# Altium project carte_action.PrjPcb
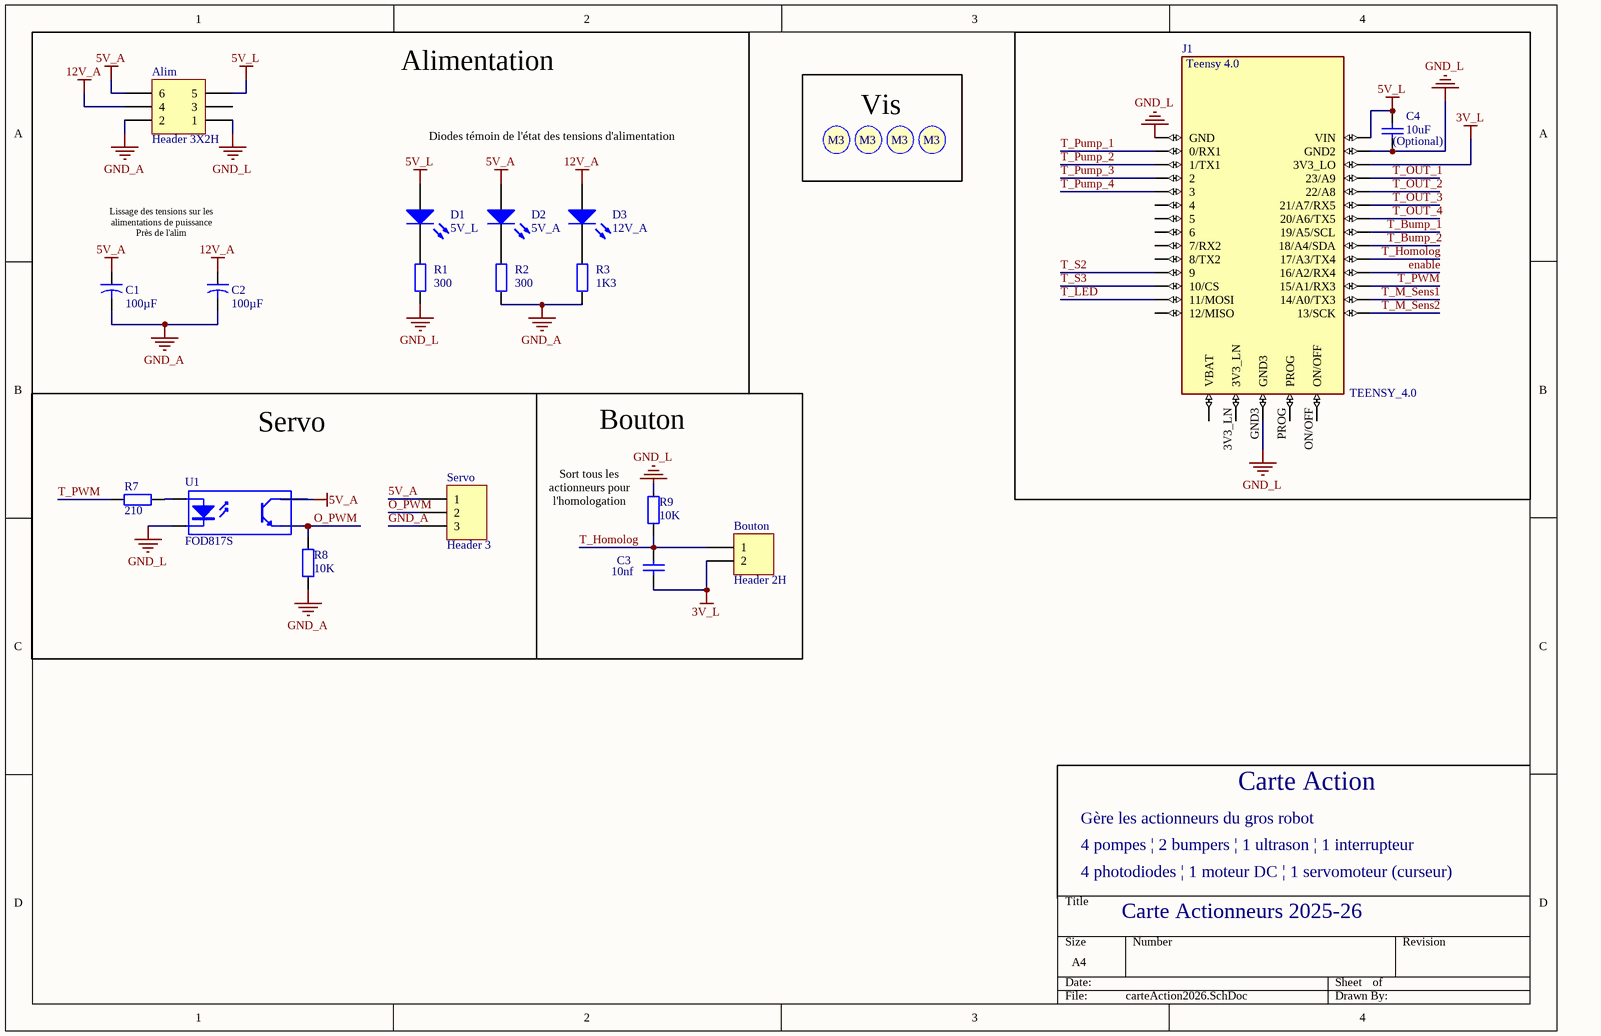
[diagram p0: carteAction2026.SchDoc]
2 sheets, 56 parts. Net scope: global (net labels, ports and power ports of the same name join across sheets).
Board file: PCBAction.PcbDoc
Sheets:
  carteAction2026.SchDoc
  SchemaAction_Actionneurs.SchDoc

## Sheet carteAction2026.SchDoc: Carte Actionneurs 2024-2025
size A4; DrawnBy: Oriane Doucet; DocumentNumber: 1/2; Revision: V1; SheetNumber: 1; SheetTotal: 2

### Parts
(Parts that share a designator on the sheet are numbered #1, #2 ... from top to bottom, then left to right.)
Alim  Header 3X2H  [MOLEX_MINIFITJR_3X2]
Bouton  Header 2H  [S2B-XH-A]
C1  value 100µF  [Condensateur]  (hidden comment: Cap2)
C2  value 100µF  [Condensateur]  (hidden comment: Cap2)
C3  value 10nf  [Capacitor 1206]  (hidden comment: Cap)
C4  (Optional)  value 10uF  [Capacitor 1206]
D1  5V_L  [KP-3216SEC]
D2  5V_A  [KP-3216SEC]
D3  12V_A  [KP-3216SEC]
J1  TEENSY_4.0  [TEENSY_4.0]
R1  value 300  [Resistor 1206]  (hidden comment: Res2)
R2  value 300  [Resistor 1206]  (hidden comment: Res2)
R3  value 1K3  [Resistor 1206]  (hidden comment: Res2)
R7  210  [Resistor 1206]
R8  value 10K  [Resistor 1206]  (hidden comment: Res2)
R9  value 10K  [Resistor 1206]  (hidden comment: Res2)
S1  Screw M3  [Screw M3]  (value not drawn)
S2  Screw M3  [Screw M3]  (value not drawn)
S3  Screw M3  [Screw M3]  (value not drawn)
S4  Screw M3  [Screw M3]  (value not drawn)
Servo  Header 3  [S3B-XH-A]
U1#1  FOD817S  [SOP254P1016X385-4N]

### Nets
3V_L: Bouton.2 C3.1 J1.3V3_LO
5V_A: Alim.6 C1.1 D2.1(A) Servo.1 U1#1.4(C)
5V_L: Alim.5 C4.2 D1.1(A) J1.VIN
12V_A: Alim.4 C2.1 D3.1(A)
GND_A: Alim.2 C1.2 C2.2 R2.2 R3.2 R8.1 Servo.3
GND_L: Alim.1 C4.1 J1.GND J1.GND2 J1.GND3 R1.1 R9.1 U1#1.2(K)
enable: J1.16/A2(16/A2/RX4)
O_PWM: R8.2 Servo.2 U1#1.3(E)
T_Bump_1: J1.19/A5/SCL
T_Bump_2: J1.18/A4/SDA
T_Homolog: Bouton.1 C3.2 J1.17/A3(17/A3/TX4) R9.2
T_LED: J1.11/MOSI
T_M_Sens1: J1.14/A0(14/A0/TX3)
T_M_Sens2: J1.13/SCK
T_OUT_1: J1.23/A9
T_OUT_2: J1.22/A8
T_OUT_3: J1.21/A7(21/A7/RX5)
T_OUT_4: J1.20/A6(20/A6/TX5)
T_Pump_1: J1.0/RX(0/RX1)
T_Pump_2: J1.1/TX(1/TX1)
T_Pump_3: J1.2
T_Pump_4: J1.3/CANTX(3)
T_PWM: J1.15/A1(15/A1/RX3) R7.1
T_S2: J1.9/CS(9)
T_S3: J1.10/CS
NetD1_2: D1.2(K) R1.2
NetD2_2: D2.2(K) R2.1
NetD3_2: D3.2(K) R3.1
NetR7_2: R7.2 U1#1.1(A)

Not connected (* = marked no-connect by the designer): Alim 3; J1 3V3_LN 4/CANRX(4) 5 6 7(7/RX2) 8(8/TX2) 12/MISO ON/OFF PROG VBAT\(VBAT)

### Notes on the sheet
- Alimentation
- Vis
- Diodes témoin de l'état des tensions d'alimentation
- Lissage des tensions sur les alimentations de puissance
  Près de l'alim
- Servo
- Bouton
- (near R9) Sort tous les actionneurs pour l'homologation
- 4 pompes | 2 bumpers | 1 ultrason | 1 interrupteur
- Gère les actionneurs du gros robot
- Carte Action
- 4 photodiodes | 1 moteur DC | 1 servomoteur (curseur)
- Carte Actionneurs 2025-26
- (in symbol Screw M3) M3

### Library data of the parts
Alim = Header 3X2H: Header, 3-Pin, Dual row, Right Angle; LatestRevisionDate: 17-Jul-2002; LatestRevisionNote: Re-released for DXP Platform.; Publisher: Altium Limited
Bouton = Header 2H: Header, 2-Pin, Right Angle; LatestRevisionDate: 17-Jul-2002; LatestRevisionNote: Re-released for DXP Platform.; Publisher: Altium Limited
C1 C2 = Cap2: Capacitor; Published: 23-Sep-2002; PackageReference: CAPR5-4X5; Publisher: Altium Limited; PackageDescription: Capacitor; 2 Leads
C3 C4 = Cap: Capacitor; Published: 8-Jun-2000; LatestRevisionDate: 17-Jul-2002; LatestRevisionNote: Re-released for DXP Platform.; PackageReference: RAD-0.3; Publisher: Altium Limited; PackageDescription: Radial Cap, Thru-Hole; 2 Leads; 0.3 in Pin Spacing
D1-D3 = LED2: Typical RED, GREEN, YELLOW, AMBER GaAs LED; Published: 8-Jun-2000; LatestRevisionDate: 17-Jul-2002; LatestRevisionNote: Re-released for DXP Platform.; PackageVersion: Feb-2002; PackageReference: 3.2X1.6X1.1; Publisher: Altium Limited; PackageDescription: SM LED; 2 Flat Leads
J1 = TEENSY_4.0: MF: PJRC; MP: Teensy 4.0; SnapEDA_Link: https://www.snapeda.com/parts/Teensy%204.0/PJRC/view-part/?ref=snap; Package: None; Value: *; Check_prices: https://www.snapeda.com/parts/Teensy%204.0/PJRC/view-part/?ref=eda
R1-R3 R7-R9 = Res2: Resistor; Published: 8-Jun-2000; LatestRevisionDate: 17-Jul-2002; LatestRevisionNote: Re-released for DXP Platform.; PackageReference: AXIAL-0.4; Publisher: Altium Limited; PackageDescription: Axial Device, Thru-Hole; 2 Leads; 0.4 in Pin Spacing
Servo = Header 3: Header, 3-Pin; LatestRevisionDate: 17-Jul-2002; LatestRevisionNote: Re-released for DXP Platform.; Publisher: Altium Limited
U1#1 = Optoisolator1: 4-Pin Phototransistor Optocoupler; Published: 24-Mar-1999; LatestRevisionDate: 04-Mar-2005; LatestRevisionNote: Sch pins 3 & 4 Swapped.; DatasheetVersion: Nov-2003; PackageReference: DIP-4; Publisher: Altium Limited

## Sheet SchemaAction_Actionneurs.SchDoc: Carte Actionneurs 2024-2025
size A4; DrawnBy: Oriane Doucet; DocumentNumber: 2/2; Revision: V1; SheetNumber: 2; SheetTotal: 2
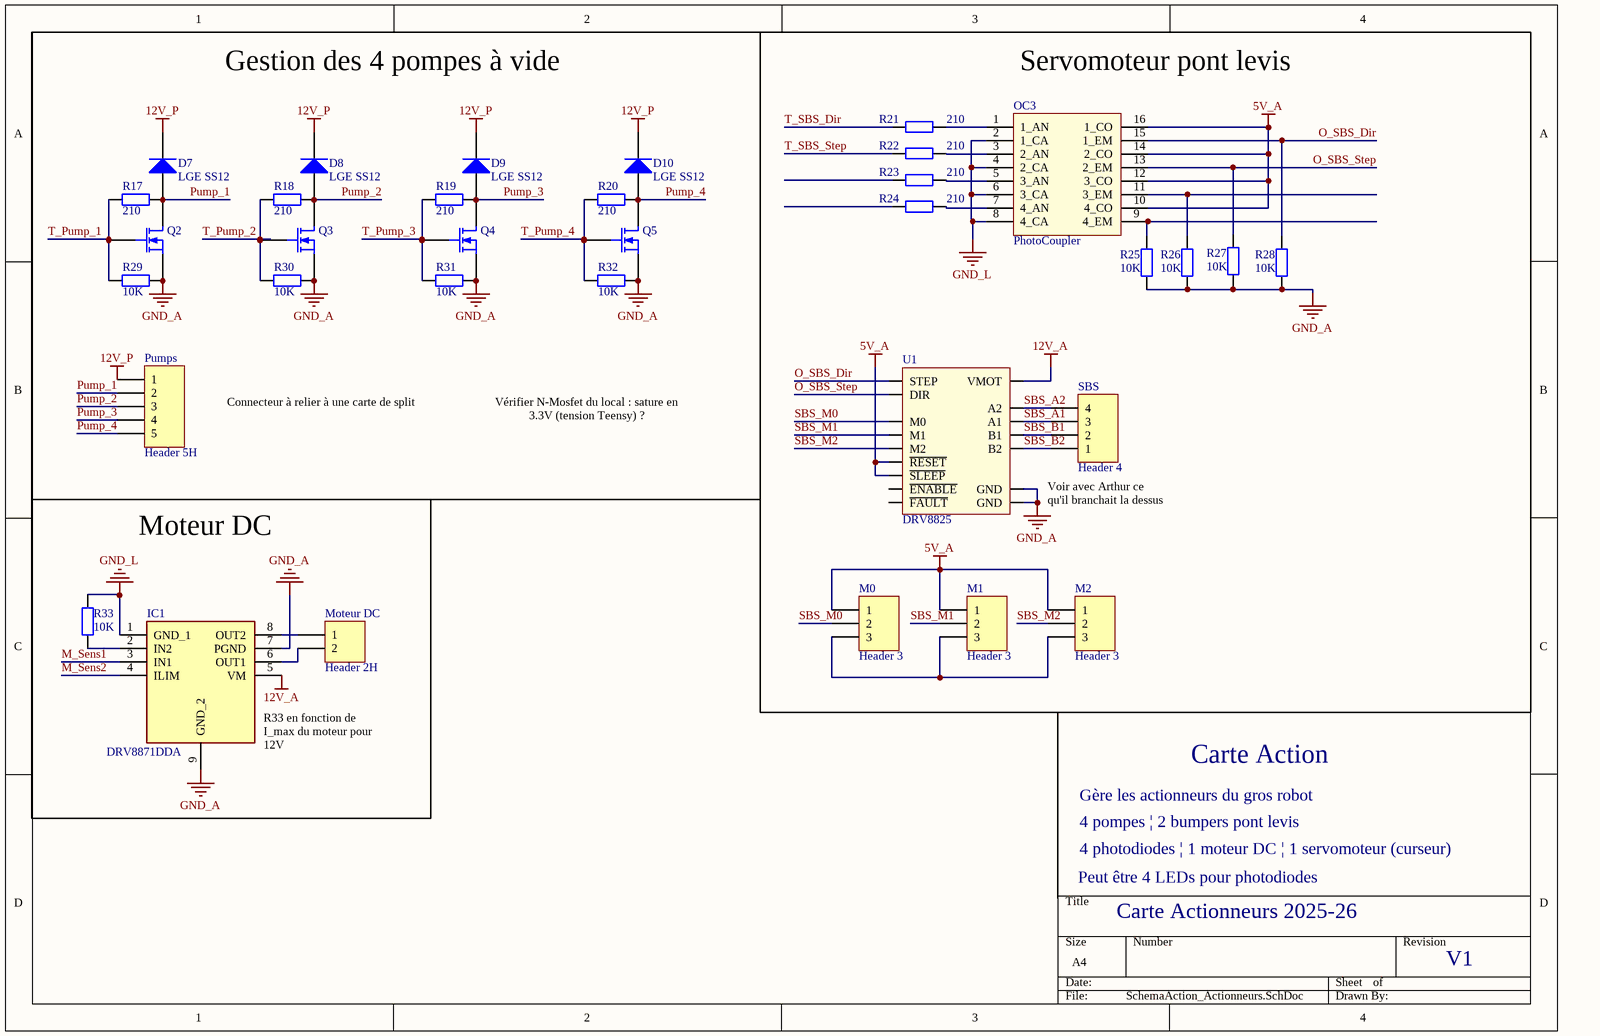
[diagram p1: SchemaAction_Actionneurs.SchDoc]

### Parts
(Parts that share a designator on the sheet are numbered #1, #2 ... from top to bottom, then left to right.)
D7  LGE SS12  [SMB]
D8  LGE SS12  [SMB]
D9  LGE SS12  [SMB]
D10  LGE SS12  [SMB]
IC1  DRV8871DDA  [SOIC127P600X170-9N]
M0  Header 3  [HDR1X3]
M1  Header 3  [HDR1X3]
M2  Header 3  [HDR1X3]
Moteur_DC  Header 2H  [HDR1X2H]
OC3  PhotoCoupler  [16 pins SOIC, TI]
Pumps  Header 5H  [HDR1X5H]
Q2  MOSFET-N  [SOT23_M]  (value not drawn)
Q3  MOSFET-N  [SOT23_M]  (value not drawn)
Q4  MOSFET-N  [SOT23_M]  (value not drawn)
Q5  MOSFET-N  [SOT23_M]  (value not drawn)
R17  value 210  [Resistor 1206]  (hidden comment: Res2)
R18  value 210  [Resistor 1206]  (hidden comment: Res2)
R19  value 210  [Resistor 1206]  (hidden comment: Res2)
R20  value 210  [Resistor 1206]  (hidden comment: Res2)
R21  value 210  [Resistor 1206]  (hidden comment: Res2)
R22  value 210  [Resistor 1206]  (hidden comment: Res2)
R23  value 210  [Resistor 1206]  (hidden comment: Res2)
R24  value 210  [Resistor 1206]  (hidden comment: Res2)
R25  value 10K  [Resistor 1206]  (hidden comment: Res2)
R26  value 10K  [Resistor 1206]  (hidden comment: Res2)
R27  value 10K  [Resistor 1206]  (hidden comment: Res2)
R28  value 10K  [Resistor 1206]  (hidden comment: Res2)
R29  value 10K  [Resistor 1206]  (hidden comment: Res2)
R30  value 10K  [Resistor 1206]  (hidden comment: Res2)
R31  value 10K  [Resistor 1206]  (hidden comment: Res2)
R32  value 10K  [Resistor 1206]  (hidden comment: Res2)
R33  value 10K  [Resistor 1206]  (hidden comment: Res2)
SBS  Header 4  [S4B-XH-A]
U1#2  DRV8825  [DRV8825]

### Nets
5V_A: M0.1 M1.1 M2.1 OC3.10(4_CO) OC3.12(3_CO) OC3.14(2_CO) OC3.16(1_CO) U1#2.5(~{RESET}) U1#2.6(~{SLEEP})
12V_A: IC1.5(VM) U1#2.16(VMOT)
12V_P: D7.2(K) D8.2(K) D9.2(K) D10.2(K) Pumps.1
GND_A: IC1.7(PGND) IC1.9(GND_2) Q2.3(S) Q3.3(S) Q4.3(S) Q5.3(S) R25.1 R26.1 R27.1 R28.1 R29.2 R30.2 R31.2 R32.2 U1#2.9(GND) U1#2.15(GND)
GND_L: IC1.1(GND_1) OC3.2(1_CA) OC3.4(2_CA) OC3.6(3_CA) OC3.8(4_CA) R33.2
M_Sens1: IC1.3(IN1)
M_Sens2: IC1.4(ILIM)
O_SBS_Dir: OC3.15(1_EM) R28.2 U1#2.7(STEP)
O_SBS_Step: OC3.13(2_EM) R27.2 U1#2.8(DIR)
Pump_1: D7.1(A) Pumps.2 Q2.1(D) R17.2
Pump_2: D8.1(A) Pumps.3 Q3.1(D) R18.2
Pump_3: D9.1(A) Pumps.4 Q4.1(D) R19.2
Pump_4: D10.1(A) Pumps.5 Q5.1(D) R20.2
SBS_A1: SBS.3 U1#2.12(A1)
SBS_A2: SBS.4 U1#2.11(A2)
SBS_B1: SBS.2 U1#2.13(B1)
SBS_B2: SBS.1 U1#2.14(B2)
SBS_M0: M0.2 U1#2.2(M0)
SBS_M1: M1.2 U1#2.3(M1)
SBS_M2: M2.2 U1#2.4(M2)
T_Pump_1: Q2.2(G) R17.1 R29.1
T_Pump_2: Q3.2(G) R18.1 R30.1
T_Pump_3: Q4.2(G) R19.1 R31.1
T_Pump_4: Q5.2(G) R20.1 R32.1
T_SBS_Dir: R21.2
T_SBS_Step: R22.2
NetIC1_2: IC1.2(IN2) R33.1
NetIC1_6: IC1.6(OUT1) Moteur_DC.2
NetIC1_8: IC1.8(OUT2) Moteur_DC.1
NetM0_3: M0.3 M1.3 M2.3
NetOC3_1: OC3.1(1_AN) R21.1
NetOC3_3: OC3.3(2_AN) R22.1
NetOC3_5: OC3.5(3_AN) R23.1
NetOC3_7: OC3.7(4_AN) R24.1
NetOC3_9: OC3.9(4_EM) R25.2
NetOC3_11: OC3.11(3_EM) R26.2

Not connected (* = marked no-connect by the designer): R23 2; R24 2; U1#2 1(~{ENABLE}) 10(~{FAULT})

### Notes on the sheet
- Gestion des 4 pompes à vide
- (near OC3) Servomoteur pont levis
- Connecteur à relier à une carte de split
- Vérifier N-Mosfet du local : sature en 3.3V (tension Teensy) ?
- Voir avec Arthur ce qu'il branchait la dessus
- Moteur DC
- (near IC1) R33 en fonction de I_max du moteur pour 12V
- Carte Action
- 4 pompes | 2 bumpers pont levis
- 4 photodiodes | 1 moteur DC | 1 servomoteur (curseur)
- Gère les actionneurs du gros robot
- Peut être 4 LEDs pour photodiodes
- Carte Actionneurs 2025-26

### Library data of the parts
D7-D10 = Diode: Default Diode; Published: 8-Jun-2000; LatestRevisionDate: 17-Jul-2002; LatestRevisionNote: Re-released for DXP Platform.; PackageVersion: Sep-1996; PackageReference: SMC; Publisher: Altium Limited; PackageDescription: DO-214-AB/SMC; 2 C-Bend Leads; Body 7.9 x 5.9 mm, inc. leads (LxW); Code_JEDEC: DO-214-AB
IC1 = DRV8871DDA: Integrated Circuit; Manufacturer_Name: Texas Instruments; Datasheet Link: http://www.ti.com/lit/ds/symlink/drv8871.pdf; Height: 1.7mm; Manufacturer_Part_Number: DRV8871DDA; Mouser Part Number: 595-DRV8871DDA; Mouser Price/Stock: https://www.mouser.co.uk/ProductDetail/Texas-Instruments/DRV8871DDA?qs=Fobv33ltQGiluwfB07aSBw%3D%3D; Arrow Part Number: DRV8871DDA; Arrow Price/Stock: https://www.arrow.com/en/products/drv8871dda/texas-instruments?utm_currency=USD&region=nac
M0-M2 = Header 3: Header, 3-Pin; LatestRevisionDate: 17-Jul-2002; LatestRevisionNote: Re-released for DXP Platform.; Publisher: Altium Limited
Moteur_DC = Header 2H: Header, 2-Pin, Right Angle; LatestRevisionDate: 17-Jul-2002; LatestRevisionNote: Re-released for DXP Platform.; Publisher: Altium Limited
OC3 = LTV-247: Integrated Circuit; Manufacturer_Name: Lite-On; Datasheet Link: http://optoelectronics.liteon.com/upload/download/DS70-2009-0014/LTV-2X7%20sereis%20Mar17.PDF; Manufacturer_Part_Number: LTV-247; Mouser Part Number: 859-LTV-247; Mouser Price/Stock: https://www.mouser.co.uk/ProductDetail/Lite-On/LTV-247/?qs=9ayhpukWNmvWpoxQBzWkFA%3D%3D; Arrow Part Number: LTV-247; Arrow Price/Stock: https://www.arrow.com/en/products/ltv-247/lite-on-technology
Pumps = Header 5H: Header, 5-Pin, Right Angle; LatestRevisionDate: 17-Jul-2002; LatestRevisionNote: Re-released for DXP Platform.; Publisher: Altium Limited
Q2-Q5 = MOSFET-N: N-Channel MOSFET; pin to pad: 2>3 3>2; Published: 8-Jun-2000; LatestRevisionDate: 17-Jul-2002; LatestRevisionNote: Re-released for DXP Platform.; PackageVersion: 1995/1996; PackageReference: E3; Publisher: Altium Limited; PackageDescription: TO, Flat Index; 3 In-Line, Axial Leads; Body Dia. 4.6mm; Lead Dia. 0.5 mm (max)
R17-R33 = Res2: Resistor; Published: 8-Jun-2000; LatestRevisionDate: 17-Jul-2002; LatestRevisionNote: Re-released for DXP Platform.; PackageReference: AXIAL-0.4; Publisher: Altium Limited; PackageDescription: Axial Device, Thru-Hole; 2 Leads; 0.4 in Pin Spacing
SBS = Header 4: Header, 4-Pin; LatestRevisionDate: 17-Jul-2002; LatestRevisionNote: Re-released for DXP Platform.; Publisher: Altium Limited
U1#2 = DRV8825: Stepper Driver Module

## Nets that join several sheets
5V_A: carteAction2026 (5 pins), SchemaAction_Actionneurs (9 pins)
12V_A: carteAction2026 (Alim.4 C2.1 D3.1), SchemaAction_Actionneurs (IC1.5 U1#2.16)
GND_A: carteAction2026 (7 pins), SchemaAction_Actionneurs (16 pins)
GND_L: carteAction2026 (8 pins), SchemaAction_Actionneurs (6 pins)
T_Pump_1: carteAction2026 (J1.0/RX), SchemaAction_Actionneurs (Q2.2 R17.1 R29.1)
T_Pump_2: carteAction2026 (J1.1/TX), SchemaAction_Actionneurs (Q3.2 R18.1 R30.1)
T_Pump_3: carteAction2026 (J1.2), SchemaAction_Actionneurs (Q4.2 R19.1 R31.1)
T_Pump_4: carteAction2026 (J1.3/CANTX), SchemaAction_Actionneurs (Q5.2 R20.1 R32.1)